# EAGLE design tinyRGB-v2 (EAGLE 5.06)
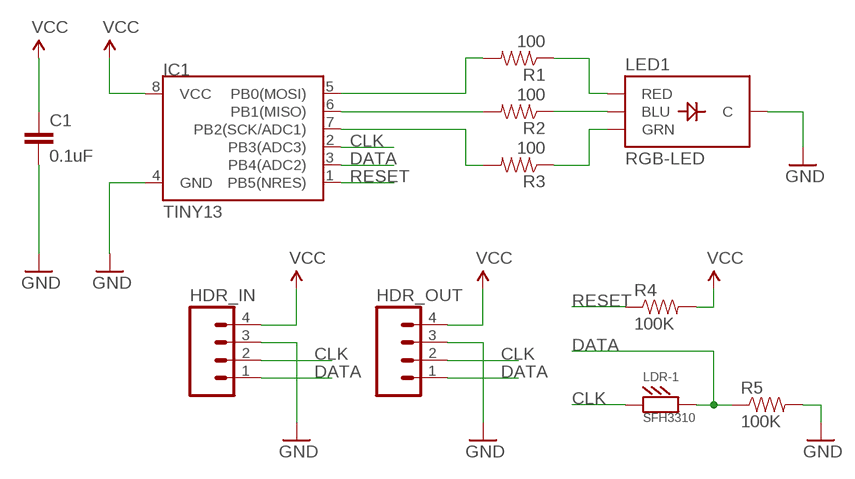
[diagram p0: schematic, sheet 1]

## Parts
C1  0.1uF  CAPPTH  [CAP-PTH-SMALL]
HDR_IN  M04PTH  [1X04]
HDR_OUT  M04PTH  [1X04]
IC1  TINY13  ATTINY13DIP  [DIP08]
LDR-1  SFH3310  LDR-906014  [LDR-906014]
LED1  RGB-LED  LED-TRICOLOR-THROUGHHOLE  [LED-TRICOLOR-THROUGHHOLE]
R1  100  RESISTORPTH1  [AXIAL-0.3]
R2  100  RESISTORPTH1  [AXIAL-0.3]
R3  100  RESISTORPTH1  [AXIAL-0.3]
R4  100K  RESISTORPTH1  [AXIAL-0.3]
R5  100K  RESISTORPTH1  [AXIAL-0.3]

## Nets
B: LED1.RED R1.P$1
CLK: HDR_IN.2 HDR_OUT.2 IC1.2(PB3(ADC3)) LDR-1.P$1
DATA: HDR_IN.1 HDR_OUT.1 IC1.3(PB4(ADC2)) LDR-1.P$2 R5.P$1
GND: C1.2 HDR_IN.3 HDR_OUT.3 IC1.4(GND) LED1.GND(C) R5.P$2
N$1: IC1.5(PB0(MOSI)) R1.P$2
N$2: IC1.6(PB1(MISO)) R2.P$2
N$3: IC1.7(PB2(SCK/ADC1)) R3.P$2
R2: LED1.BLU R2.P$1
R3: LED1.GRN R3.P$1
RESET: IC1.1(PB5(NRES)) R4.P$1
VCC: C1.1 HDR_IN.4 HDR_OUT.4 IC1.8(VCC) R4.P$2

## Library data of the parts
C1 = SparkFun:CAP: Capacitor Standard 0603 ceramic capacitor, and 0.1" leaded capacitor.
HDR_IN HDR_OUT = SparkFun:M04: Header 4 Standard 4-pin 0.1" header. Use with straight break away headers (SKU : PRT-00116), right angle break away headers (PRT-00553), swiss pins (PRT-00743), machine pins (PRT-00117), and female headers (PRT-00115). Molex polarized connector foot print use with SKU : PRT-08231 with associated crimp pins and housings.
IC1 = SparkFun:ATTINY13
LDR-1 = alex:LDR-906014
LED1 = SparkFun:LED-TRICOLOR-THROUGHHOLE
R1-R5 = SparkFun:RESISTOR: Resistor Basic schematic elements and footprints for 0603, 1206, and PTH 1/10th watt (small) resistors.

## Net classes
0 default: width 0.318 mm, drill 1.27 mm, clearance 0.318 mm

## Board
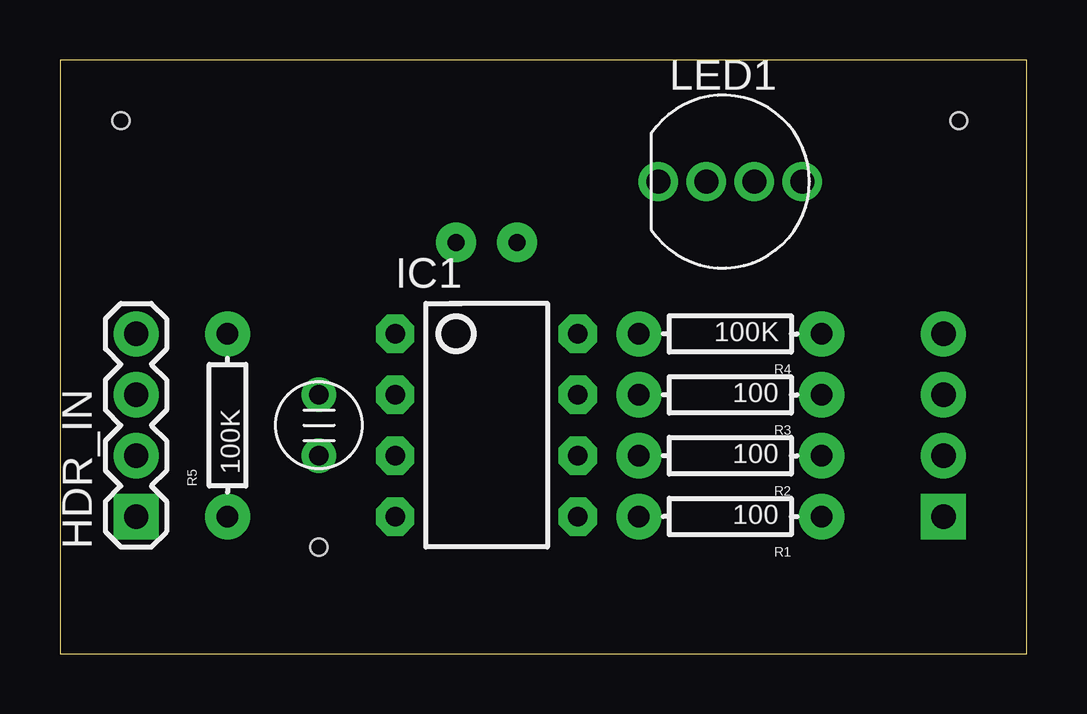
[diagram p1: board, top side]
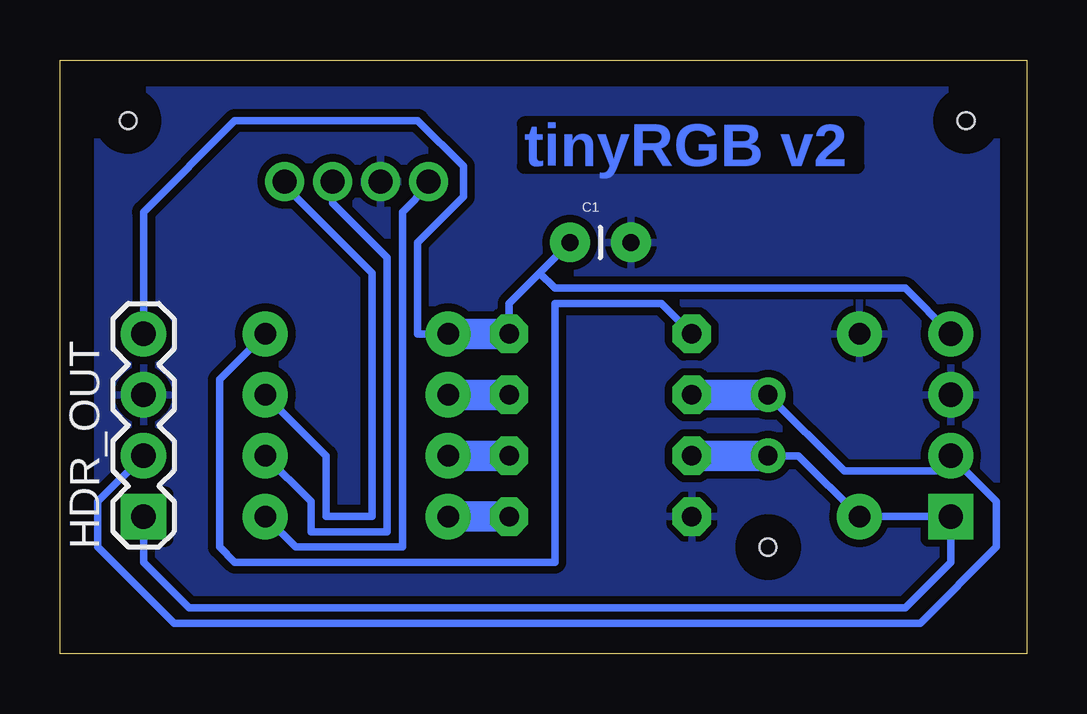
[diagram p2: board, bottom side, seen from below]

Size 40.31 x 24.75 mm. Coordinates in mm from the lower left corner, seen from the top.
Outline: 0,0 40.31,0 40.31,24.75 0,24.75 0,0
Copper layers (1*16): Top 0.035mm / dielectric 1.5mm / Bottom 0.035mm
Design rules "homebrew": minimum track width 12mil, minimum drill 25mil, track to track 12.5mil, track to pad 12.5mil, pad to pad 12.5mil, via to via 12.5mil, smd to smd 8mil, copper to edge 40mil, drill to drill 8mil, minimum pad ring 12.5mil, minimum via ring 12.5mil, stop-mask expansion 4mil, vias tented up to drill 0mil, thermal gap 10mil
Holes 0.7 mm at 2.54,22.23 10.79,4.45 37.46,22.23

### Footprints (pad centres in the part's own frame; a part is rotated, then mirrored left to right if it is on the bottom)
CAP-PTH-SMALL = drill 0.7 pad 1.651 round: 1 0,0; 2 2.54,0
1X04 = drill 1.016 pad 1.88 square: 1 0,0 | drill 1.016 pad 1.88 round: 2 2.54,0; 3 5.08,0; 4 7.62,0
DIP08 = drill 0.813 pad 1.6 octagon: 1 -3.81,-3.81; 2 -1.27,-3.81; 3 1.27,-3.81; 4 3.81,-3.81; 5 3.81,3.81; 6 1.27,3.81; 7 -1.27,3.81; 8 -3.81,3.81
LDR-906014 = drill 0.8 pad 1.27 round: P$1 0,1.27; P$2 0,-1.27
LED-TRICOLOR-THROUGHHOLE = drill 1 round: BLU 1,0; GND -1,0; GRN 3,0; RED -3,0
AXIAL-0.3 = drill 0.9 pad 1.88 round: P$1 -3.81,0; P$2 3.81,0

### Placement (x,y rotation side)
C1  19.05,17.14 0 bottom
HDR_IN  3.18,5.71 90 top
HDR_OUT  36.83,5.71 90 bottom
IC1  17.78,9.53 270 top
LDR-1  10.79,9.53 0 top
LED1  27.94,19.68 0 top
R1  27.94,5.71 180 top
R2  27.94,8.26 180 top
R3  27.94,10.79 180 top
R4  27.94,13.34 180 top
R5  6.99,9.53 90 top

### Tracks (layer width: path | path; a pad name or v marks a point on that pad's centre or on a via)
B
  Bottom 0.317: LED1.RED 24.94,19.51 26.04,18.41 26.04,4.45 30.48,4.45 R1.P$1
CLK
  Bottom 0.317: HDR_OUT.2 38.73,6.35 38.73,4.45 35.56,1.27 5.71,1.27 | 5.71,1.27 5.08,1.27 | 5.71,1.27 4.45,1.27 1.27,4.45 1.27,6.35 HDR_IN.2 3.81,7.62 7.62,7.62 LDR-1.P$1
  Bottom 1.27: LDR-1.P$1 IC1.2
DATA
  Bottom 0.317: LDR-1.P$2 9.53,8.26 R5.P$1 HDR_IN.1 3.18,3.81 5.08,1.9 34.92,1.9 36.83,3.81 HDR_OUT.1
  Bottom 1.27: LDR-1.P$2 IC1.3
GND
  pour Bottom (isolate 0.305): 38.73,1.27 38.73,23.5 1.27,23.5 1.27,1.27
N$1
  Bottom 1.27: IC1.5 R1.P$2
N$2
  Bottom 1.27: IC1.6 R2.P$2
N$3
  Bottom 1.27: IC1.7 R3.P$2
R2
  Bottom 0.317: LED1.BLU 28.94,18.78 26.67,16.51 26.67,5.08 29.84,5.08 29.84,6.35 R2.P$1
R3
  Bottom 0.317: LED1.GRN 30.94,19.51 27.3,15.88 27.3,5.71 29.21,5.71 29.21,8.26 R3.P$1
RESET
  Bottom 0.317: R4.P$1 33.65,11.43 33.65,4.45 33.02,3.81 19.68,3.81 19.68,14.61 15.24,14.61 IC1.1
VCC
  Bottom 0.317: HDR_OUT.4 36.83,18.41 33.02,22.23 25.4,22.23 23.5,20.32 23.5,19.05 25.4,17.14 25.4,13.34 R4.P$2 | HDR_IN.4 5.08,15.24 19.68,15.24 20.32,15.88 | 20.32,15.88 21.59,14.61 IC1.8 | 20.32,15.88 C1.1
  Bottom 1.27: IC1.8 R4.P$2

### Text on the board
Bottom: tinyRGB v2